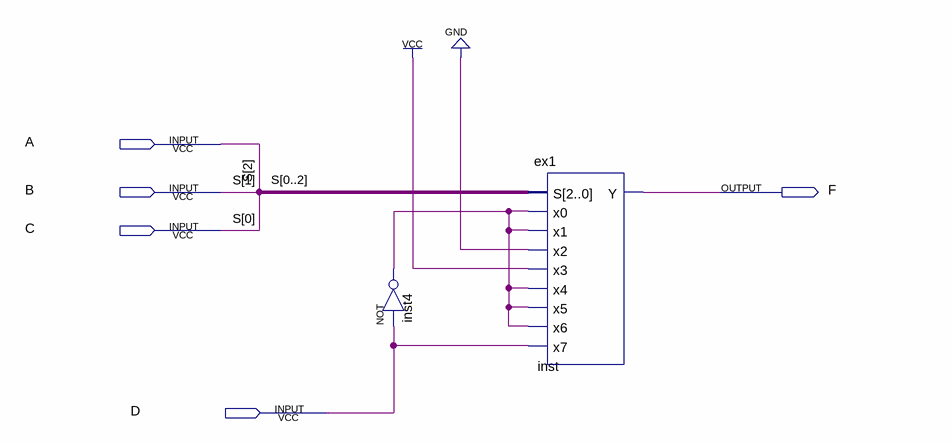
[diagram p0: schematic sheet]
// Quartus schematic ex3.bdf as structural Verilog: 2 symbols, 5 pins
module ex3 (
  input  A,
  input  B,
  input  C,
  input  D,
  output F
);

  wire inst4_out;

  not inst4 (inst4_out, D);
  ex1 inst (
    .S({C, B, A}), .x0(inst4_out), .x1(inst4_out), .x2(1'b0), .x3(1'b1), .x4(inst4_out), .x5(inst4_out),
    .x6(inst4_out), .x7(D), .Y(F));

  // Other names for the same wires on the sheet: S[2:0] = {A, B, C}
endmodule
